# EAGLE design Joystickv04 (EAGLE 7.3.0)
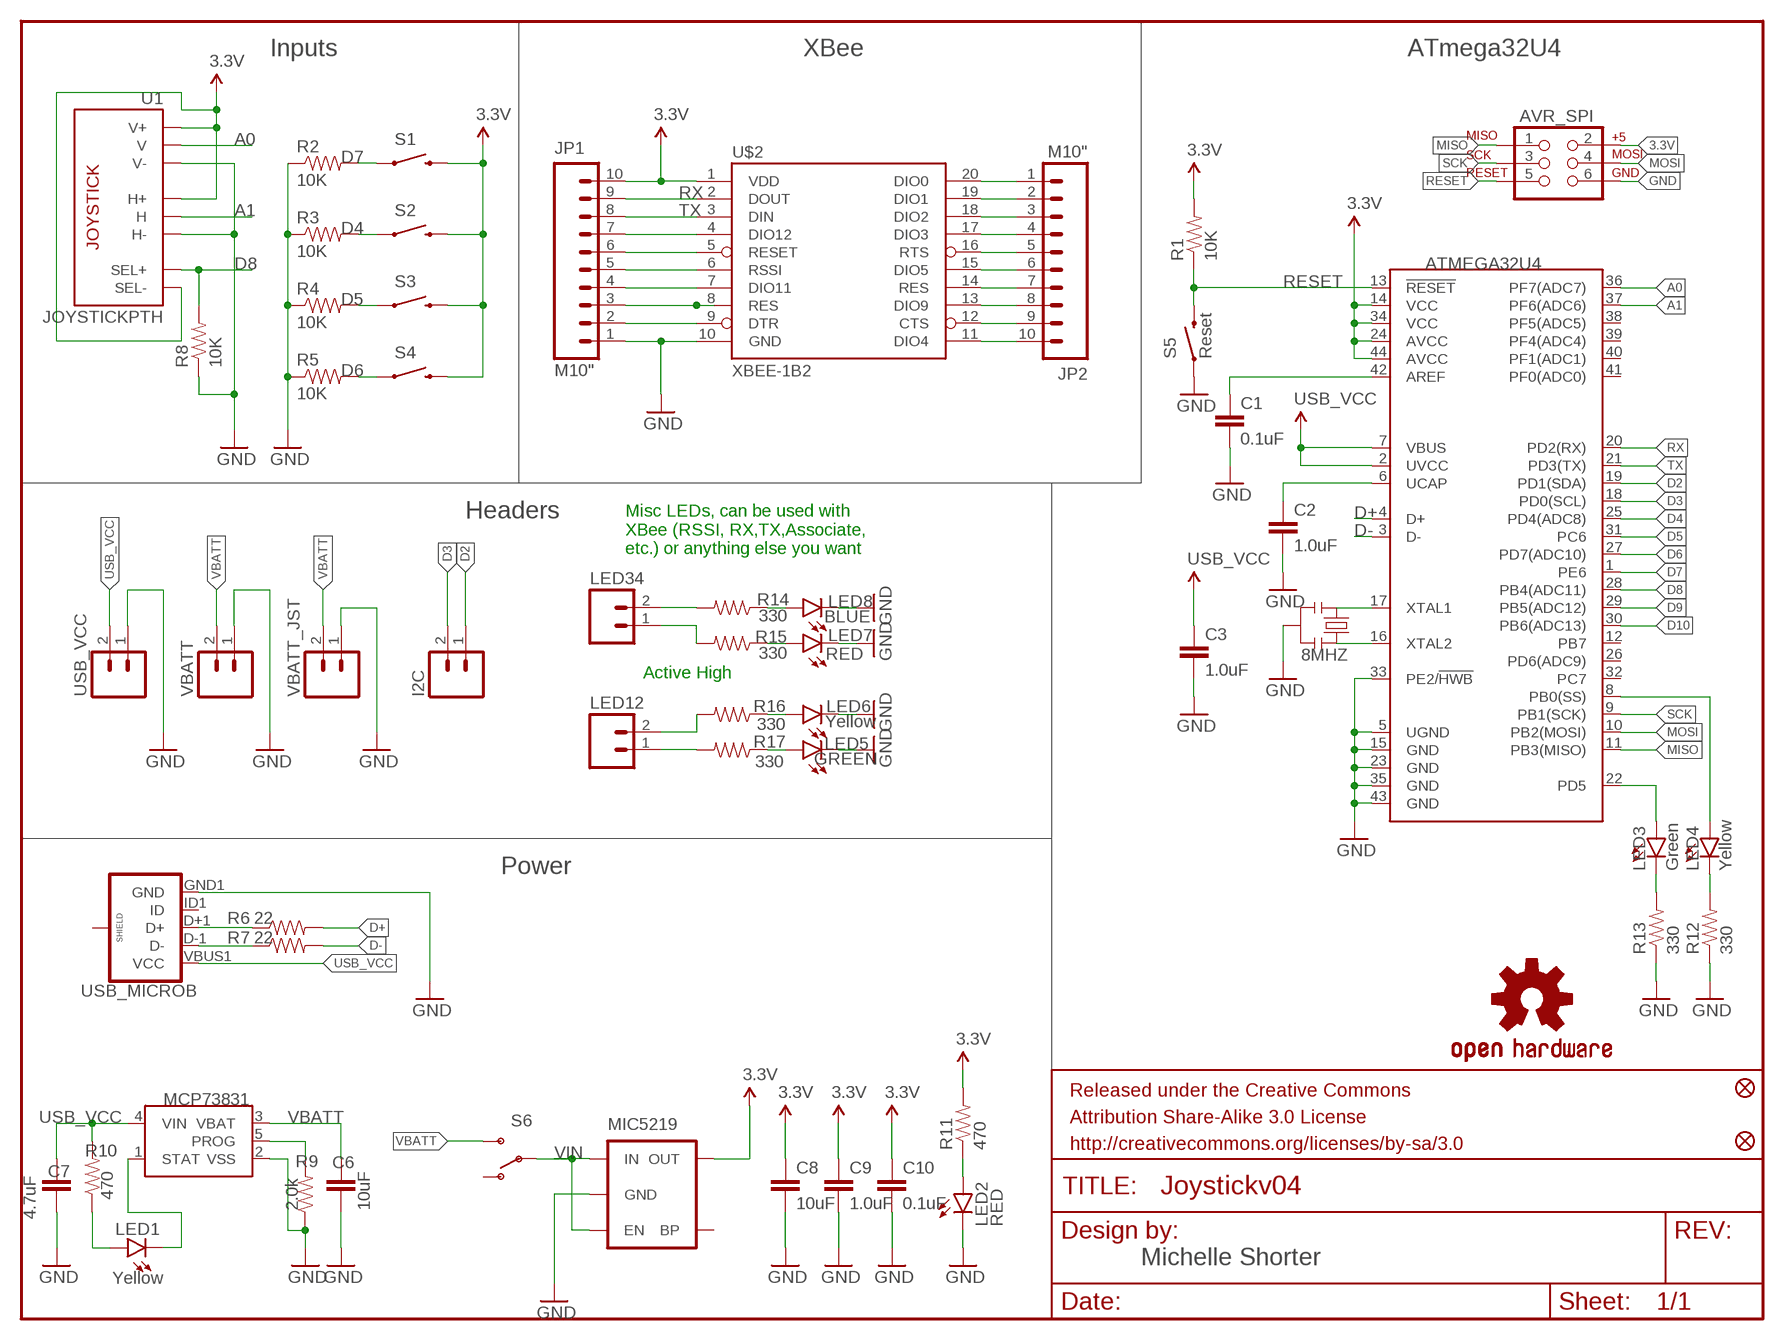
[diagram p0: schematic, sheet 1]

## Parts
ATMEGA32U4  ATMEGA32U41:1-LESS_PASTE  [QFN-44-NOPAD_1:1-LESS_PASTE]
AVR_SPI  AVR_SPI_PRG_6PTH  [2X3]
C1  0.1uF  0.1UF-25V(+80/-20%)(0603)  [0603-CAP]
C2  1.0uF  1.0UF-16V-10%(0603)  [0603-CAP]
C3  1.0uF  1.0UF-16V-10%(0603)  [0603-CAP]
C6  10uF  10UF-6.3V-20%(0603)  [0603-CAP]
C7  4.7uF  4.7UF-6.3V-10%(0603)0603  [0603-CAP]
C8  10uF  10UF-6.3V-20%(0603)  [0603-CAP]
C9  1.0uF  1.0UF-16V-10%(0603)  [0603-CAP]
C10  0.1uF  0.1UF-25V(+80/-20%)(0603)  [0603-CAP]
FID1  FIDUCIALUFIDUCIAL  [MICRO-FIDUCIAL]
FID2  FIDUCIALUFIDUCIAL  [MICRO-FIDUCIAL]
I2C  M02PTH  [1X02]
JP1  M10"  [1X10]
JP2  M10"  [1X10]
LED1  Yellow  LED-YELLOW0603  [LED-0603]
LED2  RED  LED-RED0603  [LED-0603]
LED3  Green  LED-GREEN0603  [LED-0603]
LED4  Yellow  LED-YELLOW0603  [LED-0603]
LED5  GREEN  LED-GREEN0603  [LED-0603]
LED6  Yellow  LED-YELLOW0603  [LED-0603]
LED7  RED  LED-RED0603  [LED-0603]
LED8  BLUE  LED-BLUE0603  [LED-0603]
LED12  M02PTH  [1X02]
LED34  M02PTH  [1X02]
LOGO1  OSHW-LOGOM  [OSHW-LOGO-M]
MIC5219  V_REG_MIC5219SMD  [SOT23-5]
R1  10K  10KOHM-1/10W-1%(0603)0603  [0603-RES]
R2  10K  10KOHM-1/10W-1%(0603)0603  [0603-RES]
R3  10K  10KOHM-1/10W-1%(0603)0603  [0603-RES]
R4  10K  10KOHM-1/10W-1%(0603)0603  [0603-RES]
R5  10K  10KOHM-1/10W-1%(0603)0603  [0603-RES]
R6  22  22OHM1/10W1%(0603)  [0603-RES]
R7  22  22OHM1/10W1%(0603)  [0603-RES]
R8  10K  10KOHM-1/10W-1%(0603)0603  [0603-RES]
R9  2.0k  2.0KOHM1/10W5%(0603)  [0603-RES]
R10  470  470OHM1/10W1%(0603)  [0603-RES]
R11  470  470OHM1/10W1%(0603)  [0603-RES]
R12  330  330OHM1/10W1%(0603)  [0603-RES]
R13  330  330OHM1/10W1%(0603)  [0603-RES]
R14  330  330OHM1/10W1%(0603)  [0603-RES]
R15  330  330OHM1/10W1%(0603)  [0603-RES]
R16  330  330OHM1/10W1%(0603)  [0603-RES]
R17  330  330OHM1/10W1%(0603)  [0603-RES]
S1  SWITCH-MOMENTARY-212MM  [TACTILE-PTH-12MM]
S2  SWITCH-MOMENTARY-212MM  [TACTILE-PTH-12MM]
S3  SWITCH-MOMENTARY-212MM  [TACTILE-PTH-12MM]
S4  SWITCH-MOMENTARY-212MM  [TACTILE-PTH-12MM]
S5  Reset  SWITCH-MOMENTARY-2SMD  [TACTILE-SWITCH-SMD]
S6  SWITCH-SPDTPTH  [SWITCH-SPDT]
U1  JOYSTICKPTH  [JOYSTICK]
U4  MCP73831  [SOT23-5]
U$2  XBEE-1B2  [XBEE-SILK]
U$3  8MHZ  RESONATOR8MHZ  [RESONATOR-SMD]
USB_MICROB  USB_MICROB_PLUGCONN-11752  [USB-B-MICRO-SMD_V03]
USB_VCC  M02PTH  [1X02]
VBATT  M02PTH  [1X02]
VBATT_JST  M02-JST-2MM-SMT  [JST-2-SMD]

## Nets
3.3V: ATMEGA32U4.14(VCC) ATMEGA32U4.24(AVCC) ATMEGA32U4.34(VCC) ATMEGA32U4.44(AVCC) AVR_SPI.2 C8.1 C9.1 C10.1 JP1.10 MIC5219.5(OUT) R1.2 R11.2 S1.3 S2.3 S3.3 S4.3 U1.B2A(SEL-) U1.H1(H+) U1.V1(V+) U$2.1(VDD)
A0: ATMEGA32U4.36(PF7(ADC7)) U1.V2(V)
A1: ATMEGA32U4.37(PF6(ADC6)) U1.H2(H)
D2: ATMEGA32U4.19(PD1(SDA)) I2C.1
D3: ATMEGA32U4.18(PD0(SCL)) I2C.2
D4: ATMEGA32U4.25(PD4(ADC8)) R3.2 S2.1
D5: ATMEGA32U4.31(PC6) R4.2 S3.1
D6: ATMEGA32U4.27(PD7(ADC10)) R5.2 S4.1
D7: ATMEGA32U4.1(PE6) R2.2 S1.1
D8: ATMEGA32U4.28(PB4(ADC11)) R8.2 U1.B1A(SEL+)
D9: ATMEGA32U4.29(PB5(ADC12))
D10: ATMEGA32U4.30(PB6(ADC13))
D+: ATMEGA32U4.4(D+) R6.2
D-: ATMEGA32U4.3(D-) R7.2
GND: ATMEGA32U4.5(UGND) ATMEGA32U4.15(GND) ATMEGA32U4.23(GND) ATMEGA32U4.33(PE2/!HWB) ATMEGA32U4.35(GND) ATMEGA32U4.43(GND) AVR_SPI.6 C1.2 C2.2 C3.2 C6.2 C7.2 C8.2 C9.2 C10.2 JP1.1 LED2.C LED5.C LED6.C LED7.C LED8.C MIC5219.2(GND) R2.1 R3.1 R4.1 R5.1 R8.1 R9.1 R12.1 R13.1 S5.1 U1.H3(H-) U1.V3(V-) U4.2(VSS) U$2.10(GND) U$3.2 USB_MICROB.GND1(GND) USB_VCC.1 VBATT.1 VBATT_JST.1
MISO: ATMEGA32U4.11(PB3(MISO)) AVR_SPI.1
MOSI: ATMEGA32U4.10(PB2(MOSI)) AVR_SPI.4
N$1: ATMEGA32U4.17(XTAL1) U$3.1
N$2: ATMEGA32U4.42(AREF) C1.1
N$3: R6.1 USB_MICROB.D+1(D+)
N$4: JP1.2 U$2.9(DTR)
N$5: ATMEGA32U4.6(UCAP) C2.1
N$6: ATMEGA32U4.16(XTAL2) U$3.3
N$8: JP1.3 U$2.8(RES)
N$9: R7.1 USB_MICROB.D-1(D-)
N$10: JP1.4 U$2.7(DIO11)
N$11: R9.2 U4.5(PROG)
N$12: JP1.5 U$2.6(RSSI)
N$13: JP1.6 U$2.5(RESET)
N$14: JP1.7 U$2.4(DIO12)
N$15: JP2.10 U$2.11(DIO4)
N$16: JP2.9 U$2.12(CTS)
N$17: JP2.8 U$2.13(DIO9)
N$18: JP2.7 U$2.14(RES)
N$19: JP2.6 U$2.15(DIO5)
N$20: JP2.5 U$2.16(RTS)
N$21: JP2.4 U$2.17(DIO3)
N$23: JP2.3 U$2.18(DIO2)
N$24: JP2.2 U$2.19(DIO1)
N$25: JP2.1 U$2.20(DIO0)
N$26: LED2.A R11.1
N$27: LED1.A R10.1
N$28: LED1.C U4.1(STAT)
N$29: ATMEGA32U4.8(PB0(SS)) LED4.A
N$30: LED4.C R12.2
N$31: LED3.C R13.2
N$32: ATMEGA32U4.22(PD5) LED3.A
N$33: LED12.1 R17.2
N$34: LED8.A R14.1
N$35: LED7.A R15.1
N$36: LED6.A R16.1
N$37: LED5.A R17.1
N$38: LED12.2 R16.2
N$39: LED34.1 R15.2
N$40: LED34.2 R14.2
RESET: ATMEGA32U4.13(!RESET) AVR_SPI.5 R1.1 S5.3
RX: ATMEGA32U4.20(PD2(RX)) JP1.9 U$2.2(DOUT)
SCK: ATMEGA32U4.9(PB1(SCK)) AVR_SPI.3
TX: ATMEGA32U4.21(PD3(TX)) JP1.8 U$2.3(DIN)
USB_VCC: ATMEGA32U4.2(UVCC) ATMEGA32U4.7(VBUS) C3.1 C7.1 R10.2 U4.4(VIN) USB_MICROB.VBUS1(VCC) USB_VCC.2
VBATT: C6.1 S6.3(S) U4.3(VBAT) VBATT.2 VBATT_JST.2
VIN: MIC5219.1(IN) MIC5219.3(EN) S6.2(P)
Unconnected: ATMEGA32U4.12(PB7) ATMEGA32U4.26(PD6(ADC9)) ATMEGA32U4.32(PC7) ATMEGA32U4.38(PF5(ADC5)) ATMEGA32U4.39(PF4(ADC4)) ATMEGA32U4.40(PF1(ADC1)) ATMEGA32U4.41(PF0(ADC0)) MIC5219.4(BP) S6.1(O) USB_MICROB.ID1(ID) USB_MICROB.SHIELD1(SHIELD) USB_MICROB.SHIELD2(SHIELD) USB_MICROB.SHIELD3(SHIELD)

## Notes on the sheet
- Inputs | XBee | ATmega32U4
- Headers
- Misc LEDs, can be used with
  XBee (RSSI, RX,TX,Associate,
  etc.) or anything else you want
- Active High
- Power
- Michelle Shorter

## Library data of the parts
ATMEGA32U4 = SparkFun-DigitalIC:ATMEGA32U4: Atmel 44-pin 8-bit Microcontroller with 32KBytes of ISP Flash and USB Controller
AVR_SPI = SparkFun-Connectors:AVR_SPI_PRG_6: AVR ISP 6 Pin This is the reduced ISP connector for AVR programming. Common on Arduino. This footprint will take up less PCB space and can be used with a 10-pin to 6-pin adapter such as SKU: BOB-08508
C1 C10 = SparkFun-Capacitors:0.1UF-25V(+80/-20%)(0603): CAP-00810 Ceramic Standard decoupling cap; PROD_ID: CAP-00810
C2 C3 C9 = SparkFun-Capacitors:1.0UF-16V-10%(0603): CAP-00868; PROD_ID: CAP-00868
C6 C8 = SparkFun-Capacitors:10UF-6.3V-20%(0603): CAP-11015; PROD_ID: CAP-11015
C7 = SparkFun-Capacitors:4.7UF-6.3V-10%(0603): CAP-08280; PROD_ID: CAP-08280
FID1 FID2 = SparkFun-Aesthetics:FIDUCIAL: Fiducial Alignment Points Various fiducial points for machine vision alignment.
I2C LED12 LED34 USB_VCC VBATT VBATT_JST = SparkFun-Connectors:M02: Header 2 Standard 2-pin 0.1" header. Use with straight break away headers (SKU : PRT-00116), right angle break away headers (PRT-00553), swiss pins (PRT-00743), machine pins (PRT-00117), and female headers (PRT-00115). Molex polarized connector foot print use with SKU : PRT-08233 with associated crimp pins and housings.
JP1 JP2 = SparkFun-Connectors:M10: Header 10 Standard 10-pin 0.1" header. Use with straight break away headers (SKU : PRT-00116), right angle break away headers (PRT-00553), swiss pins (PRT-00743), machine pins (PRT-00117), and female headers (PRT-00115).
LED1 LED4 LED6 = SparkFun-LED:LED-YELLOW: Yellow SMD LEDs LilyPad 1206- DIO-09909 0603- DIO-09003; PROD_ID: DIO-09003
LED2 LED7 = SparkFun-LED:LED-RED: Assorted Red LEDs LilyPad 1206- DIO-09912 1206- DIO-00809 0603- DIO-00819; PROD_ID: DIO-00819
LED3 = SparkFun-LED:LED-GREEN: Various green LEDs Green LEDs used in SFE Production 0603- DIO-00821 LARGE- DIO-00862 LILYPAD- DIO-09910; PROD_ID: DIO-00821; VALUE: GREEN
LED5 = SparkFun-LED:LED-GREEN: Various green LEDs Green LEDs used in SFE Production 0603- DIO-00821 LARGE- DIO-00862 LILYPAD- DIO-09910; PROD_ID: DIO-00821
LED8 = SparkFun-LED:LED-BLUE: Blue LEDs for production use Various blue LEDs stocked by SparkFun production 0603 - DIO-08575 Rebel - DIO-09553 1206 - DIO-09911; PROD_ID: DIO-08575
LOGO1 = SparkFun-Aesthetics:OSHW-LOGO: Open Source Hardware Logo This logo indicates the piece of hardware it is found on incorporates a OSHW license and/or adheres to the definition of open source hardware found here: http://freedomdefined.org/OSHW
MIC5219 = SparkFun-PowerIC:V_REG_MIC5219: V_REG MIC5219 Standard 500mA LDO voltage regulator in SOT-23 layout. Micrel part MIC5219. BP (by-pass) pin is used to lower output noise with 470pF cap, may be left open.
R1-R5 R8 = SparkFun-Resistors:10KOHM-1/10W-1%(0603): RES-00824; PROD_ID: RES-00824
R6 R7 = SparkFun-Resistors:22OHM1/10W1%(0603): RES-08698; PROD_ID: RES-08698
R9 = SparkFun-Resistors:2.0KOHM1/10W5%(0603): RES-08296; PROD_ID: RES-08296
R10 R11 = SparkFun-Resistors:470OHM1/10W1%(0603): RES-07869; PROD_ID: RES-07869
R12-R17 = SparkFun-Resistors:330OHM1/10W1%(0603): RES-00818; PROD_ID: RES-00818
S1-S4 = SparkFun-Electromechanical:SWITCH-MOMENTARY-2: Various NO switches- pushbuttons, reed, etc; PROD_ID: SWCH-09185
S5 = SparkFun-Electromechanical:SWITCH-MOMENTARY-2: Various NO switches- pushbuttons, reed, etc; PROD_ID: SWCH-08247
S6 = SparkFun-Electromechanical:SWITCH-SPDT: SPDT Switch Simple slide switch, Spark Fun Electronics SKU : COM-00102 DPDT SMT slide switch, AYZ0202, SWCH-08179; PROD_ID: SWCH-08261
U1 = SparkFun-Electromechanical:JOYSTICK: Thumb Joystick Joystick commonly found in PS2 controllers. Two pots and a select switch. Footprint proven. Spark Fun Electronics SKU : COM-09032
U4 = SparkFun-PowerIC:MCP73831: Miniature single cell, fully integrated Li-Ion, Li-polymer charge management controller http://ww1.microchip.com/downloads/en/DeviceDoc/21984a.pdf IC-09995; PROD_ID: IC-09995
U$2 = SparkFun-RF:XBEE-1: Xbee module footprints
U$3 = SparkFun-FreqCtrl:RESONATOR: Resonator Small SMD resonator. Used, eg, on the Arduino Pro/ Pro Mini boards. 8MHz- XTAL-08895 16MHz- XTAL-08900; PROD_ID: XTAL-08895
USB_MICROB = SparkFun-Connectors:USB_MICROB_PLUG: USB Micro-B connectors Some male, some female. Watch your step!; PROD_ID: CONN-11752

## Board
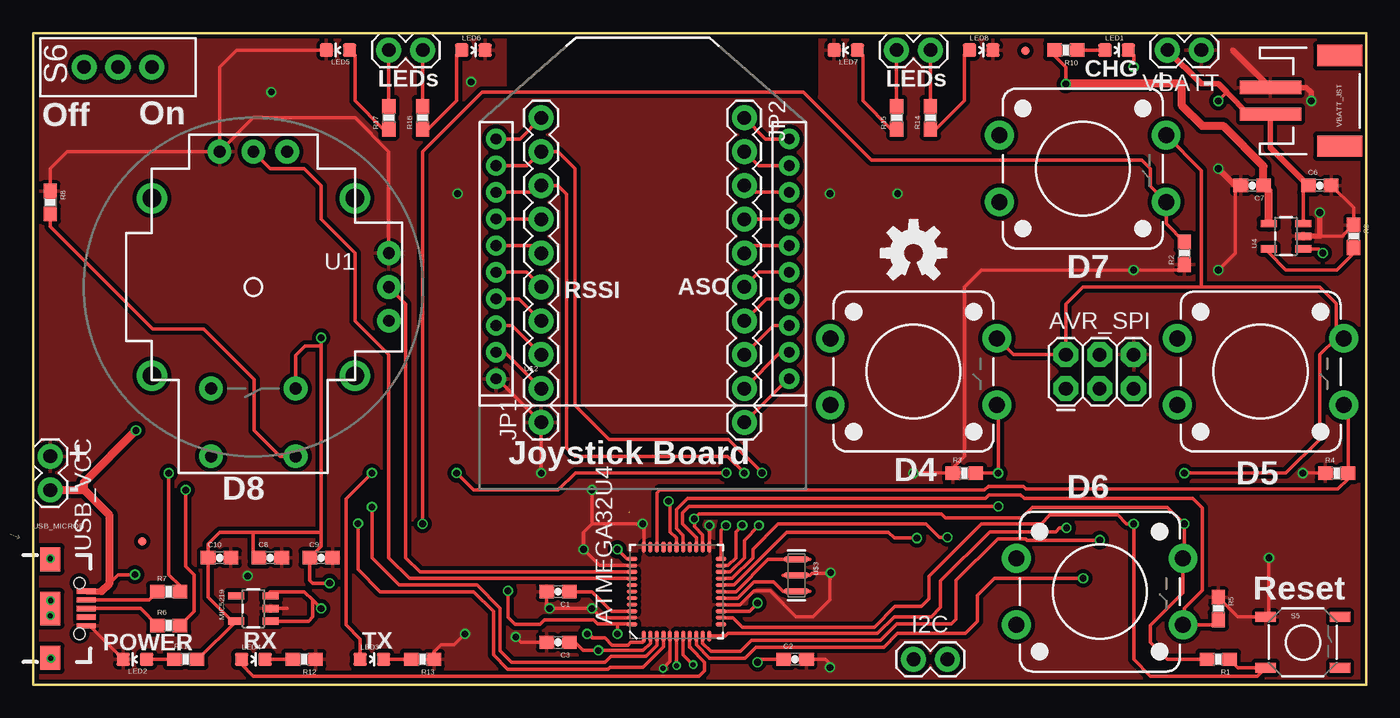
[diagram p1: board, top side]
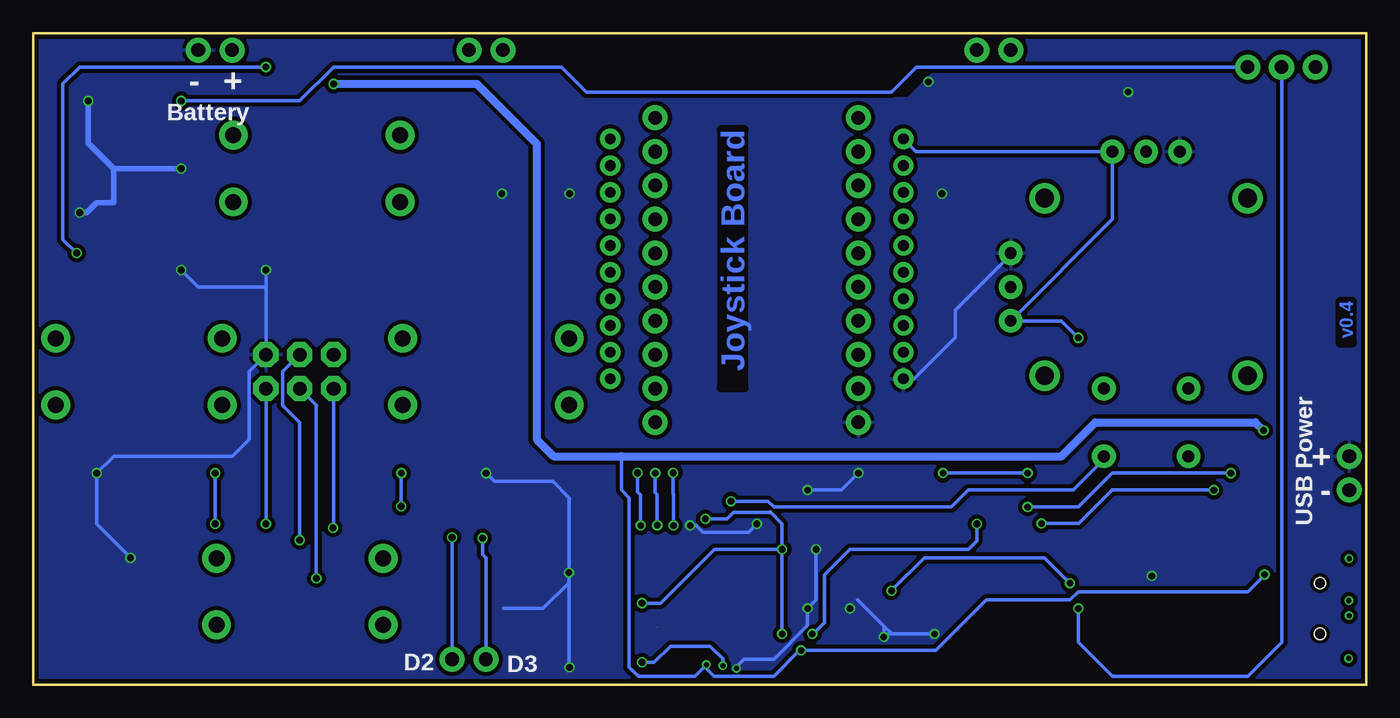
[diagram p2: board, bottom side, seen from below]

Size 100 x 48.88 mm. Coordinates in mm from the lower left corner, seen from the top.
Outline: 0,0 100,0 100,48.89 0,48.89 0,0
Copper layers (1*16): Top 0.035mm / dielectric 1.5mm / Bottom 0.035mm
Design rules "Gold_Phoenix_Standard_Spec_2_layer": minimum track width 5mil, minimum drill 6mil, track to track 5mil, track to pad 5mil, pad to pad 5mil, via to via 5mil, smd to smd 5mil, copper to edge 8mil, drill to drill 8mil, minimum pad ring 5mil, minimum via ring 5mil, stop-mask expansion 4mil, vias tented up to drill 20mil, thermal gap 10mil

### Footprints (pad centres in the part's own frame; a part is rotated, then mirrored left to right if it is on the bottom)
QFN-44-NOPAD_1:1-LESS_PASTE = smd 0.8 x 0.3: 1 -3.337,2.458; 2 -3.337,1.958; 3 -3.337,1.479; 4 -3.337,0.979; 5 -3.337,0.5; 6 -3.337,0; 7 -3.337,-0.5; 8 -3.337,-0.979; 9 -3.337,-1.479; 10 -3.337,-1.958; 11 -3.337,-2.458; 23 3.337,-2.458; 24 3.337,-1.958; 25 3.337,-1.479; 26 3.337,-0.979; 27 3.337,-0.5; 28 3.337,0; 29 3.337,0.5; 30 3.337,0.979; 31 3.337,1.479; 32 3.337,1.958; 33 3.337,2.458 | smd 0.3 x 0.8: 12 -2.458,-3.337; 13 -1.958,-3.337; 14 -1.479,-3.337; 15 -0.979,-3.337; 16 -0.5,-3.337; 17 0,-3.337; 18 0.5,-3.337; 19 0.979,-3.337; 20 1.479,-3.337; 21 1.958,-3.337; 22 2.458,-3.337; 34 2.458,3.337; 35 1.958,3.337; 36 1.479,3.337; 37 0.979,3.337; 38 0.5,3.337; 39 0,3.337; 40 -0.5,3.337; 41 -0.979,3.337; 42 -1.479,3.337; 43 -1.958,3.337; 44 -2.458,3.337
2X3 = drill 1.016 pad 1.88 octagon: 1 0,0; 2 0,2.54; 3 2.54,0; 4 2.54,2.54; 5 5.08,0; 6 5.08,2.54
0603-CAP = smd 1.1 x 1: 1 -0.85,0; 2 0.85,0
MICRO-FIDUCIAL = smd 0.635 x 0.635: 1 0,0
1X02 = drill 1.016 pad 1.88: 1 0,0; 2 2.54,0
1X10 = drill 1.016 pad 1.88: 1 0,0; 2 2.54,0; 3 5.08,0; 4 7.62,0; 5 10.16,0; 6 12.7,0; 7 15.24,0; 8 17.78,0; 9 20.32,0; 10 22.86,0
LED-0603 = smd 1 x 1: A 0,-0.877; C 0,0.877
SOT23-5 = smd 0.55 x 1.2: 1 -0.95,-1.3; 2 0,-1.3; 3 0.95,-1.3; 4 0.95,1.3; 5 -0.95,1.3
0603-RES = smd 1.1 x 1: 1 -0.85,0; 2 0.85,0
TACTILE-PTH-12MM = drill 1.2 pad 2.159: 1 6.25,-2.5; 2 -6.25,-2.5; 3 6.25,2.5; 4 -6.25,2.5
TACTILE-SWITCH-SMD = smd 1.524 x 0.762: 1 -2.794,1.905; 2 2.794,1.905; 3 -2.794,-1.905; 4 2.794,-1.905
SWITCH-SPDT = drill 1.016 pad 1.88: 1 0,2.54; 2 0,0; 3 0,-2.54
JOYSTICK = drill 0.9 pad 1.778: B1A -3.175,12.7; B1B 3.175,12.7; B2A -3.175,7.62; B2B 3.175,7.62 | drill 0.889 pad 1.778: H1 -2.54,-10.16; H2 0,-10.16; H3 2.54,-10.16; V1 -10.16,2.54; V2 -10.16,0; V3 -10.16,-2.54 | drill 1.397 pad 2.286: MOUNT1 -7.62,6.668; MOUNT2 -7.62,-6.668; MOUNT3 7.62,-6.668; MOUNT4 7.62,6.668
XBEE-SILK = drill 0.8 pad 1.524: 1 -11,20; 2 -11,18; 3 -11,16; 4 -11,14; 5 -11,12; 6 -11,10; 7 -11,8; 8 -11,6; 9 -11,4; 10 -11,2; 11 11,2; 12 11,4; 13 11,6; 14 11,8; 15 11,10; 16 11,12; 17 11,14; 18 11,16; 19 11,18; 20 11,20
RESONATOR-SMD = smd 0.45 x 1.905: 1 -1.2,0; 2 0,0; 3 1.2,0
USB-B-MICRO-SMD_V03 = smd 1.4 x 0.4: D+1 2.7,0; D-1 2.7,0.65; GND1 2.7,-1.3; ID1 2.7,-0.65; VBUS1 2.7,1.3 | smd 1.5 x 1.8: SHIELD1 0,3.7; SHIELD2 0,-3.7 | smd 1.5 x 2.5: SHIELD3 0,0 | hole 0.85: 2.2,1.9; 2.2,-1.9
JST-2-SMD = smd 1 x 4.6: 1 -1,-3.7; 2 1,-3.7 | smd 1.6 x 3.4: NC1 -3.4,1.5; NC2 3.4,1.5

### Placement (x,y rotation side)
ATMEGA32U4  48.26,6.99 90 top
AVR_SPI  77.47,22.23 0 top
C1  39.37,6.99 180 top
C2  57.15,1.91 0 top
C3  39.37,3.17 180 top
C6  96.52,37.46 0 top
C7  91.44,37.46 180 top
C8  17.78,9.52 0 top
C9  21.59,9.52 0 top
C10  13.97,9.52 0 top
FID1  8.18,10.74 0 top
FID2  74.42,47.57 0 top
I2C  68.58,1.91 180 top
JP1  38.1,19.69 90 top
JP2  53.34,42.54 270 top
LED1  81.28,47.62 270 top
LED2  7.62,1.91 90 top
LED3  25.4,1.91 270 top
LED4  16.51,1.91 270 top
LED5  22.86,47.62 90 top
LED6  33.02,47.62 270 top
LED7  60.96,47.62 90 top
LED8  71.12,47.62 270 top
LED12  26.67,47.62 0 top
LED34  64.77,47.62 0 top
LOGO1  66.04,32.38 0 top
MIC5219  16.51,5.72 90 top
R1  88.9,1.91 180 top
R2  86.36,32.38 90 top
R3  69.85,15.88 0 top
R4  97.79,15.88 0 top
R5  88.9,5.72 270 top
R6  10.16,4.45 0 top
R7  10.16,6.99 0 top
R8  1.27,36.2 270 top
R9  99.06,33.66 270 top
R10  77.47,47.62 180 top
R11  11.43,1.91 0 top
R12  20.32,1.91 180 top
R13  29.21,1.91 180 top
R14  67.31,42.54 90 top
R15  64.77,42.54 90 top
R16  29.21,42.54 90 top
R17  26.67,42.54 90 top
S1  78.74,38.73 0 top
S2  66.04,23.5 0 top
S3  92.08,23.5 0 top
S4  80.01,6.99 0 top
S5  95.25,3.17 0 top
S6  6.35,46.35 90 top
U1  16.51,29.85 180 top
U4  93.98,33.66 90 top
U$2  45.72,20.96 0 top
U$3  57.25,8.2 270 top
USB_MICROB  1.27,5.72 0 top
USB_VCC  1.27,17.14 270 top
VBATT  87.63,47.62 180 top
VBATT_JST  96.52,43.81 270 top

### Tracks (layer width: path | path; a pad name or v marks a point on that pad's centre or on a via)
3.3V  (via drill 0.5, 0.51)  (1 unrouted)
  Top 0.254: ATMEGA32U4.14 53.72,5.51 v54.33,6.12 | 44.83,4.57 44.78,4.57 | 44.78,4.57 43.76,4.57 | 43.76,4.57 42.34,4.57 42.04,4.88 38.37,4.88 38.01,4.51 36.15,4.51 35.61,5.05 v35.61,7.04 | v22.23,7.62 20.96,7.62 20.74,7.84 C9.1 21.59,10.38 21.59,11.43 | S2.3 73.52,24.77 AVR_SPI.2 77.47,28.58 78.74,29.85 87.63,29.85 | v86.36,15.88 93.98,15.88 96.52,18.42 96.52,24.77 97.75,26 | R1.2 85.09,1.91 83.82,3.18 83.82,4.45 86.26,6.89 S4.3 86.3,9.53 86.36,9.53 v86.36,12.07 v86.35,12.07 85.09,13.32 74.94,13.32 74.14,12.52 68.43,12.52 68.15,12.8 49.94,12.8 v49.58,12.45 49.61,12.42 49.61,11.86 50.22,11.25 ATMEGA32U4.24 | R11.2 12.35,1.91 MIC5219.5 14.92,4.77 13.12,6.57 C10.1 13.12,10.58 13.97,11.43 16.51,11.43 | U$2.1 36.51,40.96 JP1.10 | v21.59,26.04 21.59,25.43 | 21.59,25.43 21.59,11.43 | 87.63,29.85 96.52,29.85 97.75,28.62 97.75,26 | 87.63,29.85 87.63,38.6 S1.3 | 16.51,11.43 21.59,11.43 | C8.1 16.51,9.53 16.51,11.43 | 44.53,4.53 ATMEGA32U4.44 44.83,4.53 44.78,4.57 | ATMEGA32U4.34 44.53,9.44 v43.82,10.16 | S3.3 97.75,26 | U1.B2A 19.69,24.71 20.4,25.43 21.59,25.43 | S1.3 | v43.82,3.81 43.82,4.52 43.76,4.57
  Bottom 0.254: v22.23,7.62 24.13,9.53 33.15,9.53 35.61,7.06 v35.61,7.04 | v86.36,12.07 v86.36,15.88 | U$2.1 33.77,40.01 U1.H1 19.05,34.93 U1.V1 22.86,27.31 v21.59,26.04 | v43.82,3.81 v43.82,10.16 | v49.58,12.45 47.96,12.45 47.47,12.93 44.7,12.93 44.68,12.9 | 44.7,12.95 43.82,12.07 v43.82,10.16 | v43.82,10.16 48.9,10.16 52.93,6.12 v54.33,6.12
A0
  Top 0.254: ATMEGA32U4.36 29,8.46 27.94,9.53 27.94,28.58 U1.V2
A1
  Top 0.254: ATMEGA32U4.37 28.23,7.96 26.67,9.53 26.67,24.77 24.13,27.31 24.13,32.39 21.59,34.93 21.59,37.47 20.32,38.74 17.78,38.74 U1.H2
D2  (via drill 0.5)
  Top 0.254: ATMEGA32U4.19 52.41,7.96 53.98,9.53 53.98,10.16 55.88,12.07 66.98,12.07 68,11.05 v68.58,11.05
  Bottom 0.254: v68.58,11.05 I2C.1
D3  (via drill 0.5)
  Top 0.254: ATMEGA32U4.18 52.57,7.49 56.52,11.43 64.16,11.43 64.59,11 v66.29,11
  Bottom 0.254: v66.29,11 66.29,9.78 66.04,9.53 I2C.2
D4  (via drill 0.5, 0.51)
  Top 0.254: R3.2 v72.39,15.88 72.39,20.88 72.29,20.98 S2.1 | ATMEGA32U4.25 49.74,11.07 49.72,11.07 48.72,12.07 48.72,12.88 49.2,13.36 72.39,13.36 v72.4,13.37
  Bottom 0.254: v72.39,15.88 72.39,13.39 v72.4,13.37
D5
  Top 0.254: ATMEGA32U4.31 46.78,14.4 46.99,14.61 71.37,14.61 71.65,14.88 74.27,14.88 74.47,14.68 97.87,14.68 98.64,15.46 R4.2 98.64,20.68 S3.1
D6
  Top 0.254: ATMEGA32U4.27 48.76,11.22 48.25,11.73 48.25,13.14 49.07,13.97 71.43,13.97 71.7,14.25 74.07,14.25 74.35,13.97 87,13.97 87.69,13.27 87.69,7.07 87.71,7.06 86.36,5.72 86.36,4.59 S4.1 88.52,4.49 R5.2
D7  (via drill 0.5)
  Top 0.254: ATMEGA32U4.1 45.8,3.26 45.72,3.18 44.81,3.18 44.6,2.97 43.43,2.97 42.9,3.51 41.99,3.51 | v29.21,12.07 29.21,40.01 33.66,44.45 57.79,44.45 62.87,39.37 83.19,39.37 83.82,38.74 83.82,37.41 S1.1 84.99,34.61 R2.2 | 41.99,3.51 41.91,3.51 | v41.55,3.81 41.68,3.81 41.99,3.51
  Bottom 0.254: v29.21,12.07 29.21,10.8 29.85,10.16 38.74,10.16 40.64,8.26 40.64,4.65 41.48,3.81 v41.55,3.81
D8  (via drill 0.5)
  Top 0.254: ATMEGA32U4.28 48.26,11 47.78,11.48 47.78,13.51 47.8,13.54 47.65,13.69 v47.65,13.77 | R8.2 1.27,34.39 8.97,26.7 12.78,26.7 16.59,22.89 16.59,19.08 18.52,17.15 U1.B1A
  Bottom 0.254: v47.65,13.77 44.88,13.77 44.45,13.34 31.12,13.34 29.85,14.61 21.97,14.61 19.69,16.89 U1.B1A
D+  (via drill 0.5, 0.51)
  Top 0.254: ATMEGA32U4.4 47.28,2.83 45.75,1.3 43.26,1.3 43.13,1.17 35.59,1.17 34.52,2.24 34.52,5.49 33.02,6.99 26.04,6.99 24.36,8.66 v24.36,12.09 | v11.43,14.61 11.43,8.89 12.07,8.26 12.07,5.5 R6.2
  Bottom 0.254: v24.36,12.09 21.56,12.09 19.05,14.61 v11.43,14.61
D-  (via drill 0.5, 0.51)
  Top 0.254: ATMEGA32U4.3 46.78,2.94 45.97,2.13 43.33,2.13 42.88,1.68 35.89,1.68 35.03,2.54 35.03,5.74 33.29,7.48 27.45,7.48 25.4,9.53 v25.4,13.34 | R7.2 11.01,7.41 10.16,8.26 v10.16,15.88
  Bottom 0.254: v25.4,13.34 21.59,13.34 19.05,15.88 v10.16,15.88
GND  (via drill 0.38, 0.5, 0.51)
  Top 0.254: ATMEGA32U4.43 42.6,5.03 v41.91,5.72 v38.74,5.72 38.52,5.93 C1.2 | ATMEGA32U4.15 53.02,6.01 54.05,7.04 55.3,7.04 57.23,5.11 58.5,5.11 59.77,6.38 59.77,8.37 58.43,8.37 58.27,8.2 | ATMEGA32U4.5 47.76,1.74 v47.24,1.22 | C2.2 59.44,1.91 59.77,1.57 v59.77,1.3 | R4.1 v95.25,15.88 | v92.71,9.53 92.71,5.33 S5.1 90.39,5.08 R5.1 | LED2.C 4.23,4.42 USB_MICROB.GND1 | U$2.10 34.83,22.96 JP1.1 v38.1,15.88 | 96.52,33.66 98.21,33.66 R9.1 99.06,35.79 97.38,37.47 C6.2 | MIC5219.2 19.05,5.72 | 41.91,12.07 v45.72,12.07 45.8,11.98 ATMEGA32U4.33 | 41.91,12.07 41.28,11.43 v41.28,10.16 42.49,8.94 ATMEGA32U4.35 | 41.91,12.07 v41.91,14.61 | v66.04,15.88 R3.1 69,16.28 69.85,17.13 69.85,29.85 71.12,31.12 v82.55,31.12 85.93,31.12 R2.1 | v32.39,3.81 31.57,3 30.61,3 30.06,2.45 R13.1 | 90.17,37.47 90.17,32.39 v88.9,31.12 | LED5.C 15.24,47.63 13.97,46.36 U1.H3 | U1.H3 2.54,40.01 1.27,38.74 R8.1 | U1.H3 16.51,42.55 24.13,42.55 26.67,40.01 U1.V3 | C3.2 36.6,3.18 v36.2,3.58 | ATMEGA32U4.23 v50.72,11.93 v50.72,11.94
  Top 0.406: 90.01,47.63 VBATT_JST.1 95.52,44.82 95.89,44.45 v95.89,43.82 | v88.9,38.74 90.17,37.47 C7.2 | U4.2 96.52,33.66 v96.52,35.43
  Bottom 0.254: v41.28,10.16 41.28,6.35 v41.91,5.72 41.91,4.45 44.45,1.91 46.69,1.91 47.24,1.35 v47.24,1.22 | v92.71,9.53 95.25,12.07 v95.25,15.88 93.98,17.15 85.09,17.15 83.82,18.42 83.82,23.5 AVR_SPI.6 82.55,29.85 | v41.91,14.61 39.37,14.61 v38.1,15.88 | v50.72,11.94 50.25,11.94 50.25,11.93 49.76,11.43 46.36,11.43 v45.72,12.07 | v66.04,15.88 65.41,15.24 61.01,15.24 59.77,14 59.82,13.94 v59.82,8.41 59.82,7.65 | v32.39,3.81 35.97,3.81 v36.2,3.58 36.2,4.39 | 82.55,29.85 v82.55,31.12 | v88.9,31.12 87.63,29.85 82.55,29.85 | 59.82,7.65 59.82,1.35 v59.77,1.3 | 64.71,5.72 61.75,5.72 59.82,7.65 | U$2.10 33.92,22.96 30.81,26.06 30.81,28.13 26.67,32.28 U1.V3 | 36.2,4.39 38.18,6.38 | 36.2,4.39 35.64,3.84
  Bottom 0.406: v95.89,43.82 95.89,40.64 93.98,38.74 | 93.98,38.74 v88.9,38.74 | 93.98,38.74 93.98,36.2 95.25,36.2 96.01,35.43 v96.52,35.43
  other vias: 64.85,36.86 59.77,36.86 31.83,36.86 17.86,44.48 16.08,8.15 32.84,45.24
  pour Top (isolate 0.305): -0.08,0.08 100.01,0.08 99.97,48.89 59.77,49.05 59,48.79 59,44.22 58.75,43.97 35.38,43.97 35.38,49.05 29.69,48.89 0,48.89
  pour Bottom (isolate 0.305): 0.18,0.08 100.25,0.08 100.33,48.89 63.32,48.79 58.5,43.97 34.37,43.97 29.44,48.89 0,48.89
MISO  (via drill 0.5)
  Top 0.254: ATMEGA32U4.11 51.93,3.65 52.12,3.84 63.32,3.84 64.59,5.11 67.39,5.11 68.07,5.79 68.07,7.8 71.76,11.48 76.71,11.48 76.99,11.76 v77.52,11.76
  Bottom 0.254: 77.48,11.86 77.52,11.82 v77.52,11.76 77.47,11.81 AVR_SPI.1
MOSI  (via drill 0.51)
  Top 0.254: ATMEGA32U4.10 50.22,3.12 50.85,2.49 53.06,2.49 53.9,3.33 63.56,3.33 64.81,4.57 68.89,4.57 69.22,4.9 69.22,7.81 69.23,7.81 72.35,10.93 74.46,10.93 74.55,10.85 v80.01,10.85
  Bottom 0.254: v80.01,10.85 80.01,19.69 81.28,20.96 81.28,23.5 AVR_SPI.4
N$1
  Top 0.254: ATMEGA32U4.17 52.72,6.99 55.14,9.4 56.24,9.4
N$2
  Top 0.254: ATMEGA32U4.42 43.39,5.51 41.91,6.99 C1.1
N$3
  Top 0.254: USB_MICROB.D+1 8.04,5.72 R6.1
N$4
  Top 0.254: U$2.9 35.37,24.96 JP1.2
N$5  (via drill 0.38, 0.5)
  Top 0.254: ATMEGA32U4.6 v48.26,1.42 48.26,1.83 | v54.33,1.68 54.38,1.68 54.61,1.91 C2.1
  Bottom 0.254: v54.33,1.68 53.42,1.68 52.2,2.9 49.23,2.9 48.26,1.93 v48.26,1.42
N$6
  Top 0.254: ATMEGA32U4.16 52.84,6.49 54.06,7.71 55.53,7.71 56.24,7
N$7  (via drill 0.38)
  other vias: 1.3,6.31
N$8
  Top 0.254: U$2.8 35.91,26.96 JP1.3
N$9
  Top 0.254: USB_MICROB.D-1 8.69,6.37 R7.1
N$10
  Top 0.254: U$2.7 36.45,28.96 JP1.4
N$11
  Top 0.254: R9.2 99.06,32.39 97.79,31.12 93.98,31.12 92.68,32.42 U4.5
N$12
  Top 0.254: U$2.6 36.99,30.96 JP1.5
N$13
  Top 0.254: U$2.5 37.53,32.96 JP1.6
N$14
  Top 0.254: U$2.4 38.07,34.96 JP1.7
N$15
  Top 0.254: U$2.11 56.61,22.96 JP2.10
N$16
  Top 0.254: U$2.12 56.07,24.96 JP2.9
N$17
  Top 0.254: U$2.13 55.53,26.96 JP2.8
N$18
  Top 0.254: U$2.14 54.99,28.96 JP2.7
N$19
  Top 0.254: U$2.15 54.45,30.96 JP2.6
N$20
  Top 0.254: U$2.16 53.91,32.96 JP2.5
N$21
  Top 0.254: U$2.17 53.37,34.96 JP2.4
N$22  (via drill 0.38)
  other vias: 1.28,5.18
N$23
  Top 0.254: U$2.18 53.85,36.96 JP2.3
N$24
  Top 0.254: U$2.19 54.39,38.96 JP2.2
N$25
  Top 0.254: U$2.20 54.93,40.96 JP2.1
N$26
  Top 0.254: LED2.A R11.1
N$27
  Top 0.254: R10.1 LED1.A
N$28  (via drill 0.51)
  Top 0.254: U4.1 96.43,32.71 v96.75,32.39 | v82.55,46.36 82.55,47.23 LED1.C
  Bottom 0.254: v82.55,46.36 96.52,46.36 97.79,45.09 97.79,33.41 96.76,32.39 v96.75,32.39
N$29
  Top 0.254: ATMEGA32U4.8 49.24,2.81 49.29,2.81 49.29,2.76 50.37,1.68 50.37,1.04 49.96,0.64 16.51,0.64 15.63,1.51 LED4.A
N$30
  Top 0.254: LED4.C R12.2
N$31
  Top 0.254: R13.2 LED3.C
N$32  (via drill 0.5, 0.51)
  Top 0.254: ATMEGA32U4.22 51.6,11.57 v51.97,11.94 | v51.99,15.9 40.67,15.9 39.37,14.61 33.02,14.61 v31.75,15.88 | v25.4,15.88 23.46,13.93 23.46,4.48 24.52,3.42 LED3.A
  Bottom 0.254: v51.99,15.9 51.99,14.35 51.97,14.33 v51.97,11.94 | v31.75,15.88 v25.4,15.88
N$33
  Top 0.254: R17.2 LED12.1
N$34
  Top 0.254: R14.1 67.73,41.7 69.85,43.82 69.85,47.23 LED8.A
N$35
  Top 0.254: R15.1 64.35,41.7 62.23,43.82 62.23,47.23 LED7.A
N$36
  Top 0.254: R16.1 29.63,41.7 31.75,43.82 31.75,47.23 LED6.A
N$37
  Top 0.254: R17.1 26.25,41.7 24.13,43.82 24.13,47.23 LED5.A
N$38
  Top 0.254: R16.2 LED12.2
N$39
  Top 0.254: R15.2 LED34.1
N$40
  Top 0.254: R14.2 LED34.2
N$41  (via drill 0.38)
  other vias: 1.28,9.46
N$42  (via drill 0.38)
  other vias: 1.31,1.97
RESET  (via drill 0.51)  (1 unrouted)
  Top 0.254: ATMEGA32U4.13 52.5,5.03 53.21,4.32 | 53.21,4.32 63.09,4.32 64.64,5.87 66.62,5.87 67.18,6.43 67.18,8.14 67.2,8.14 71.12,12.07 75.62,12.07 76.28,12.73 81.36,12.73 82.02,12.07 v82.55,12.07 | R1.1 90.39,1.27 S5.3 91.82,0.64 83.82,0.64 82.55,1.91 v82.55,12.07 | v82.55,12.07 82.52,12.07
  Bottom 0.254: v82.55,12.07 AVR_SPI.5
RX  (via drill 0.5, 0.51)
  Top 0.254: ATMEGA32U4.20 52.28,8.46 53.34,9.53 53.34,10.85 v54.43,11.94 | U$2.2 37.05,38.96 JP1.9 39.37,40.01 40.64,38.74 40.64,20.96 43.18,18.42 52.16,18.42 v54.66,15.91 v54.66,15.9
  Bottom 0.254: v54.43,11.94 54.43,14.25 54.66,14.48 v54.66,15.9
SCK  (via drill 0.51)
  Top 0.254: ATMEGA32U4.9 49.74,2.99 50.75,1.98 53.39,1.98 54.22,2.81 63.82,2.81 64.85,3.84 69.93,3.84 70.84,4.75 70.84,6.71 72.11,7.98 v78.77,7.98
  Bottom 0.254: AVR_SPI.3 78.74,20.96 78.77,20.93 v78.77,7.98
TX  (via drill 0.5, 0.51)
  Top 0.254: ATMEGA32U4.21 52.12,8.94 52.71,9.53 52.71,11.48 v53.19,11.96 | v53.34,15.88 52.07,17.15 40.64,17.15 40.01,17.78 40.01,36.83 39.37,37.47 JP1.8 37.59,36.96 U$2.3
  Bottom 0.254: v53.34,15.88 53.34,14.43 53.19,14.27 v53.19,11.96
USB_VCC  (via drill 0.38, 0.5, 0.51)
  Top 0.254: ATMEGA32U4.2 46.3,3.12 45.75,2.57 v42.39,2.57 41.25,2.57 40.64,3.18 C3.1 | ATMEGA32U4.7 48.76,2.24 v49.5,1.5 | 92.68,37.08 C7.1 | R10.2 76.62,47.21 77.47,46.36 v77.47,45.09 | v7.62,8.26 6.35,8.26 5.72,7.62
  Top 0.457: USB_MICROB.VBUS1 5.11,7.02
  Top 0.61: USB_VCC.2 3.81,14.61 | 3.81,14.61 5.72,12.7 5.72,7.62 5.11,7.02 | U4.4 92.68,37.08 | C7.1 92.29,38.91 89.27,41.94 87.71,41.94 86.14,43.5 86.14,45.09 v77.47,45.09 | v7.7,19.08 3.81,15.19 3.81,14.61
  Bottom 0.254: v7.62,8.26 8.89,6.99 21.59,6.99 22.23,6.35 28.5,6.35 32.28,2.57 v42.39,2.57 42.52,2.57 44.45,0.64 48.95,0.64 49.61,1.3 | 55.88,17.15 55.88,14.61 55.3,14.02 55.3,1.32 54.61,0.64 50.37,0.64 v49.5,1.5
  Bottom 0.61: v77.47,45.09 66.73,45.09 62.23,40.59 62.23,18.42 60.96,17.15 55.88,17.15 22.86,17.15 20.32,19.69 8.31,19.69 v7.7,19.08
VBATT  (via drill 0.51)
  Top 0.254: U4.3 95.28,37.08 C6.1 | v88.9,43.82 89.54,44.45
  Top 0.406: VBATT.2 87.63,45.09 88.9,45.09 89.54,44.45 91.17,42.82 VBATT_JST.2 92.82,40.32 C6.1
  Bottom 0.254: v88.9,43.82 80.01,43.82 77.47,46.36 60.38,46.36 58.5,44.48 35.64,44.48 33.76,46.36 S6.3
VIN  (via drill 0.5)
  Top 0.254: MIC5219.3 17.81,6.95 17.78,6.99 20.32,6.99 20.96,6.35 | 20.96,6.35 20.96,5.08 20.64,4.77 MIC5219.1 | 20.96,6.35 v21.59,5.72
  Bottom 0.254: v21.59,5.72 21.59,3.18 19.05,0.64 8.89,0.64 6.35,3.18 S6.2

### Text on the board
Bottom: Joystick Board | v0.4
tPlace: CHG | LEDs | LEDs | On | + | - | Off | D7 | RSSI | ASO | + | Joystick Board | D4 | D5 | - | D8 | D6 | Reset | POWER | RX | TX
bPlace: + | - | Battery | USB Power | + | - | D3 | D2